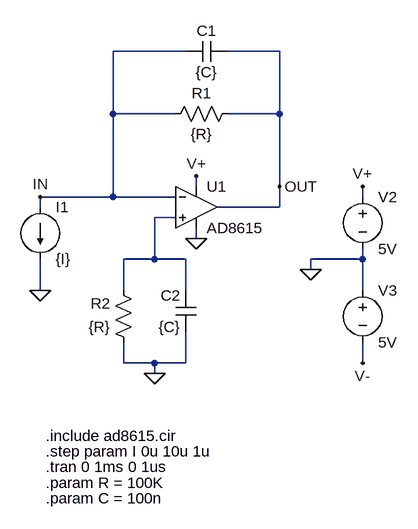
[diagram p0: schematic 001transimpedance_current_step_100k.asc]
001transimpedance_current_step_100k.asc, the LTspice schematic file:
Version 4
SHEET 1 1124 680
WIRE 176 -80 64 -80
WIRE 320 -80 240 -80
WIRE 64 16 64 -80
WIRE 160 16 64 16
WIRE 320 16 320 -80
WIRE 320 16 240 16
WIRE 192 128 192 112
WIRE 320 128 320 16
WIRE 64 144 64 16
WIRE 64 144 -48 144
WIRE 160 144 64 144
WIRE 448 144 448 128
WIRE -48 160 -48 144
WIRE 320 160 320 128
WIRE 320 160 224 160
WIRE 160 176 128 176
WIRE 192 208 192 192
WIRE 128 240 128 176
WIRE 128 240 80 240
WIRE 176 240 128 240
WIRE 448 240 448 224
WIRE 448 240 368 240
WIRE 368 256 368 240
WIRE -48 288 -48 240
WIRE 80 288 80 240
WIRE 176 288 176 240
WIRE 448 288 448 240
WIRE 80 400 80 368
WIRE 128 400 80 400
WIRE 176 400 176 352
WIRE 176 400 128 400
WIRE 448 400 448 368
WIRE 128 416 128 400
FLAG 192 112 V+
FLAG 448 128 V+
FLAG 448 400 V-
FLAG 368 256 0
FLAG 320 128 OUT
FLAG -48 288 0
FLAG 192 208 0
FLAG -48 144 IN
FLAG 128 416 0
SYMBOL Opamps\\opamp2 192 96 R0
SYMATTR InstName U1
SYMATTR Value AD8615
SYMBOL res 256 0 R90
WINDOW 0 0 56 VBottom 2
WINDOW 3 32 56 VTop 2
SYMATTR InstName R1
SYMATTR Value {R}
SYMBOL voltage 448 128 R0
WINDOW 123 0 0 Left 2
WINDOW 39 0 0 Left 2
SYMATTR InstName V2
SYMATTR Value 5V
SYMBOL voltage 448 272 R0
WINDOW 123 0 0 Left 2
WINDOW 39 0 0 Left 2
SYMATTR InstName V3
SYMATTR Value 5V
SYMBOL current -48 160 R0
WINDOW 123 0 0 Left 2
WINDOW 39 0 0 Left 2
SYMATTR InstName I1
SYMATTR Value {I}
SYMBOL cap 240 -96 R90
WINDOW 0 0 32 VBottom 2
WINDOW 3 32 32 VTop 2
SYMATTR InstName C1
SYMATTR Value {C}
SYMBOL res 96 384 R180
WINDOW 0 36 76 Left 2
WINDOW 3 36 40 Left 2
SYMATTR InstName R2
SYMATTR Value {R}
SYMBOL cap 192 352 R180
WINDOW 0 24 56 Left 2
WINDOW 3 24 8 Left 2
SYMATTR InstName C2
SYMATTR Value {C}
TEXT -40 512 Left 2 !.include ad8615.cir
TEXT -40 536 Left 2 !.step param I 0u 10u 1u
TEXT -40 560 Left 2 !.tran 0 1ms 0 1us
TEXT -40 584 Left 2 !.param R = 100K
TEXT -40 608 Left 2 !.param C = 100n

The netlist it stands for:
* 001transimpedance_current_step_100k.asc
XU1 N001 IN V+ 0 OUT AD8615  ; pins In+ In- V+ V- OUT
R1 OUT IN {R}
V2 V+ 0 5V
V3 0 V- 5V
I1 IN 0 {I}
C1 OUT IN {C}
R2 0 N001 {R}
C2 0 N001 {C}
.include ad8615.cir
.step param I 0u 10u 1u
.tran 0 1ms 0 1us
.param R = 100K
.param C = 100n
.backanno
.end